# EAGLE design fmc-host-io-breakout (EAGLE 9.0.1)
DESIGNER: JON NEWMAN; DESIGN_NAME: FMC DESERIALIZER; LICENSE: CERN OHL v1.2; REVISION: 1.2
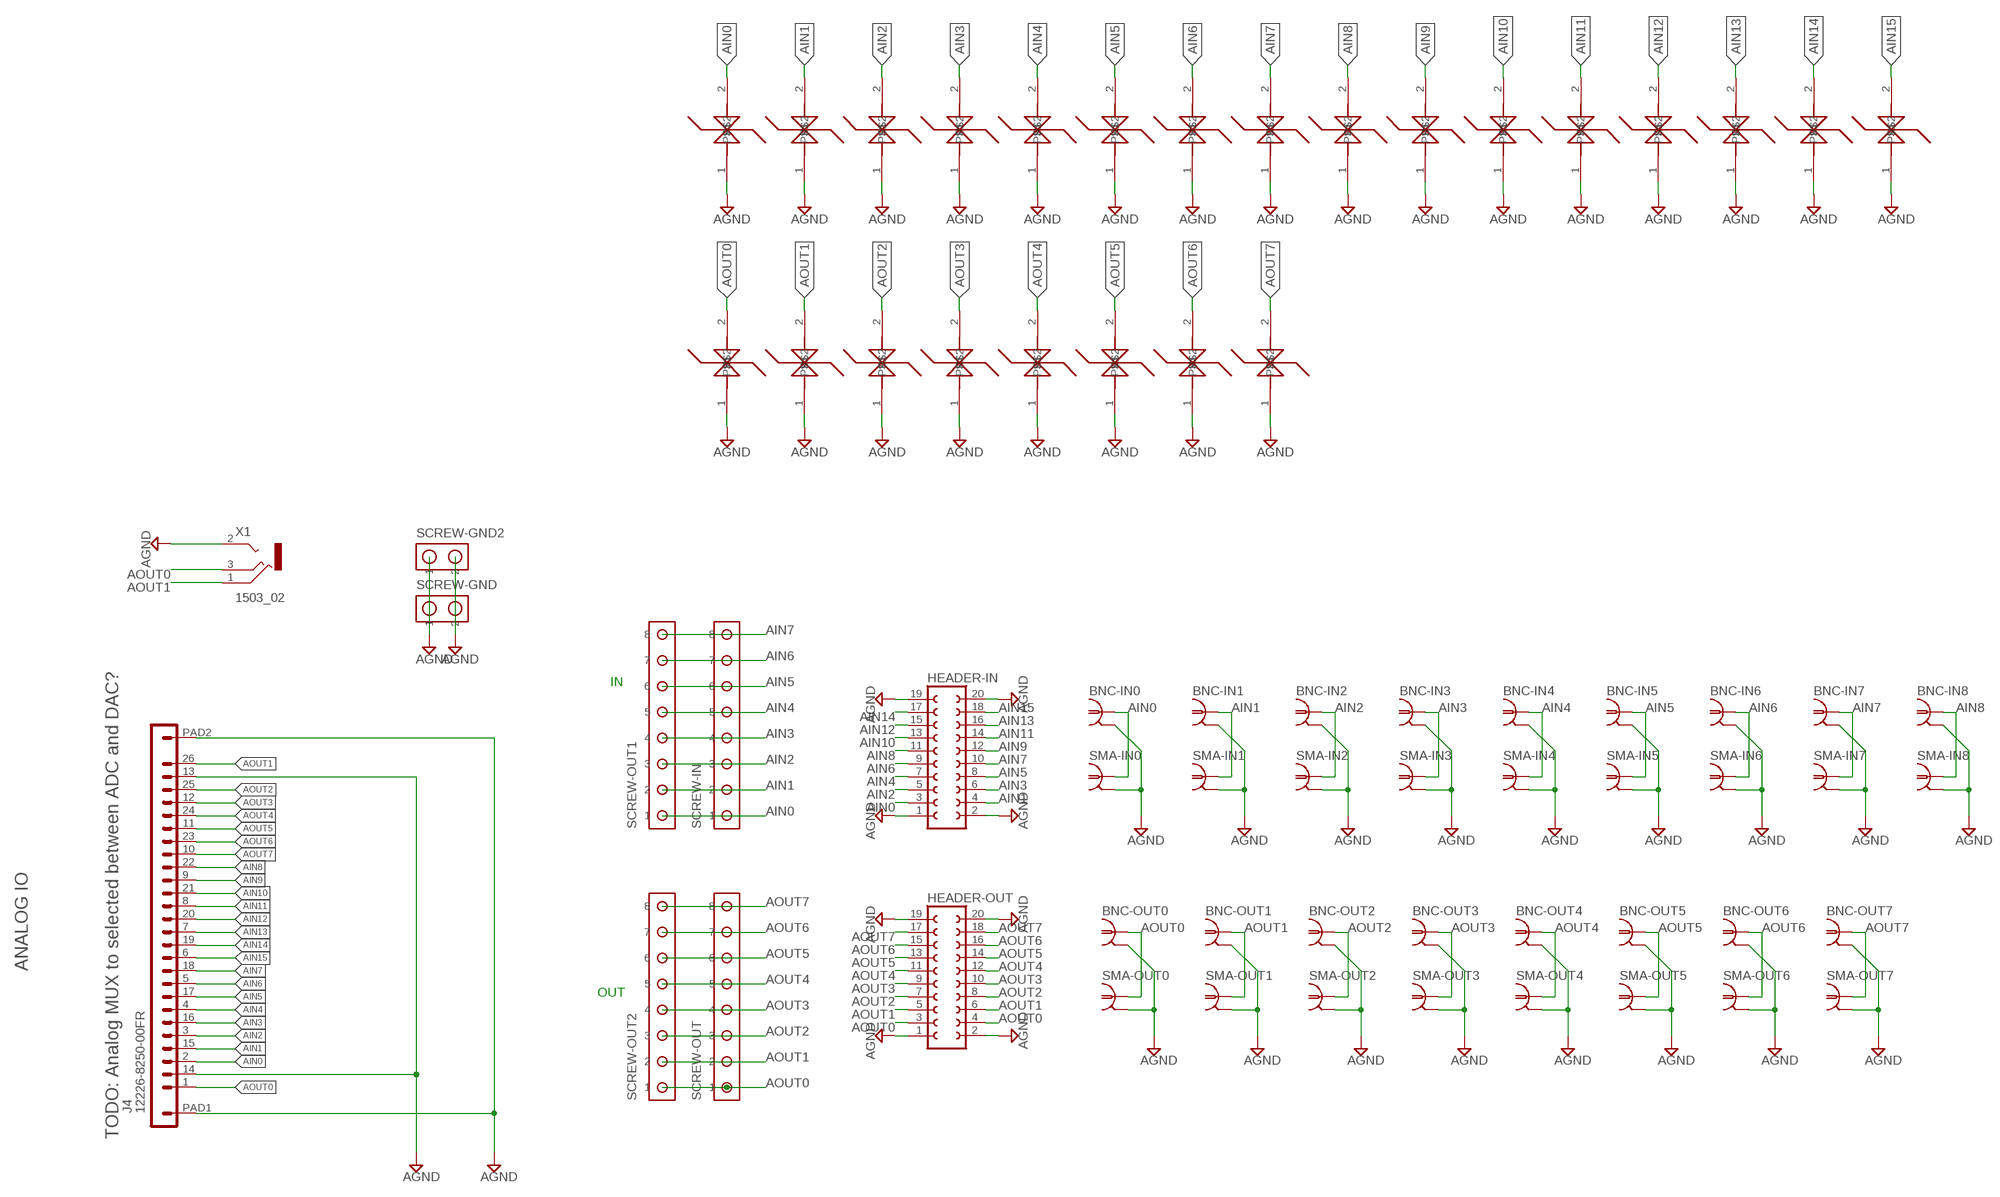
[diagram p0: schematic, sheet 1, part 1 of 2]
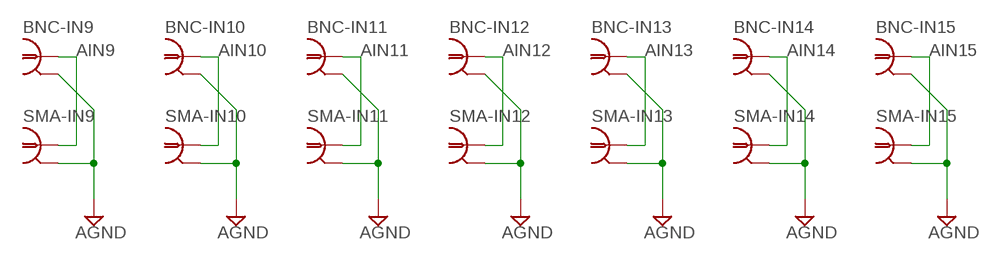
[diagram p1: schematic, sheet 1, part 2 of 2]

## Parts
BNC-IN0  COAX_B35N61  [B35N61]
BNC-IN1  COAX_B35N61  [B35N61]
BNC-IN2  COAX_B35N61  [B35N61]
BNC-IN3  COAX_B35N61  [B35N61]
BNC-IN4  COAX_B35N61  [B35N61]
BNC-IN5  COAX_B35N61  [B35N61]
BNC-IN6  COAX_B35N61  [B35N61]
BNC-IN7  COAX_B35N61  [B35N61]
BNC-IN8  COAX_B35N61  [B35N61]
BNC-IN9  COAX_B35N61  [B35N61]
BNC-IN10  COAX_B35N61  [B35N61]
BNC-IN11  COAX_B35N61  [B35N61]
BNC-IN12  COAX_B35N61  [B35N61]
BNC-IN13  COAX_B35N61  [B35N61]
BNC-IN14  COAX_B35N61  [B35N61]
BNC-IN15  COAX_B35N61  [B35N61]
BNC-OUT0  COAX_B35N61  [B35N61]
BNC-OUT1  COAX_B35N61  [B35N61]
BNC-OUT2  COAX_B35N61  [B35N61]
BNC-OUT3  COAX_B35N61  [B35N61]
BNC-OUT4  COAX_B35N61  [B35N61]
BNC-OUT5  COAX_B35N61  [B35N61]
BNC-OUT6  COAX_B35N61  [B35N61]
BNC-OUT7  COAX_B35N61  [B35N61]
HEADER-IN  FE10-2  [FE10-2]
HEADER-OUT  FE10-2  [FE10-2]
J4  12226-8250-00FR  PINHD-1X26_122  [12226-82X0-00XX]
SCREW-GND  SCREW2  [SCREW2]
SCREW-GND2  SCREW2  [SCREW2]
SCREW-IN  SCREW8  [SCREW8]
SCREW-OUT  SCREW8  [SCREW8]
SCREW-OUT1  SCREW8  [SCREW8]
SCREW-OUT2  SCREW8  [SCREW8]
SMA-IN0  COAX_SMA-VERT  [SMA_JACK_142-0701-201]
SMA-IN1  COAX_SMA-VERT  [SMA_JACK_142-0701-201]
SMA-IN2  COAX_SMA-VERT  [SMA_JACK_142-0701-201]
SMA-IN3  COAX_SMA-VERT  [SMA_JACK_142-0701-201]
SMA-IN4  COAX_SMA-VERT  [SMA_JACK_142-0701-201]
SMA-IN5  COAX_SMA-VERT  [SMA_JACK_142-0701-201]
SMA-IN6  COAX_SMA-VERT  [SMA_JACK_142-0701-201]
SMA-IN7  COAX_SMA-VERT  [SMA_JACK_142-0701-201]
SMA-IN8  COAX_SMA-VERT  [SMA_JACK_142-0701-201]
SMA-IN9  COAX_SMA-VERT  [SMA_JACK_142-0701-201]
SMA-IN10  COAX_SMA-VERT  [SMA_JACK_142-0701-201]
SMA-IN11  COAX_SMA-VERT  [SMA_JACK_142-0701-201]
SMA-IN12  COAX_SMA-VERT  [SMA_JACK_142-0701-201]
SMA-IN13  COAX_SMA-VERT  [SMA_JACK_142-0701-201]
SMA-IN14  COAX_SMA-VERT  [SMA_JACK_142-0701-201]
SMA-IN15  COAX_SMA-VERT  [SMA_JACK_142-0701-201]
SMA-OUT0  COAX_SMA-VERT  [SMA_JACK_142-0701-201]
SMA-OUT1  COAX_SMA-VERT  [SMA_JACK_142-0701-201]
SMA-OUT2  COAX_SMA-VERT  [SMA_JACK_142-0701-201]
SMA-OUT3  COAX_SMA-VERT  [SMA_JACK_142-0701-201]
SMA-OUT4  COAX_SMA-VERT  [SMA_JACK_142-0701-201]
SMA-OUT5  COAX_SMA-VERT  [SMA_JACK_142-0701-201]
SMA-OUT6  COAX_SMA-VERT  [SMA_JACK_142-0701-201]
SMA-OUT7  COAX_SMA-VERT  [SMA_JACK_142-0701-201]
U$1  DIODE-ESD-BIDIRECTIONALDO-214AA  [DIOC7026X260]
U$2  DIODE-ESD-BIDIRECTIONALDO-214AA  [DIOC7026X260]
U$3  DIODE-ESD-BIDIRECTIONALDO-214AA  [DIOC7026X260]
U$4  DIODE-ESD-BIDIRECTIONALDO-214AA  [DIOC7026X260]
U$5  DIODE-ESD-BIDIRECTIONALDO-214AA  [DIOC7026X260]
U$6  DIODE-ESD-BIDIRECTIONALDO-214AA  [DIOC7026X260]
U$7  DIODE-ESD-BIDIRECTIONALDO-214AA  [DIOC7026X260]
U$8  DIODE-ESD-BIDIRECTIONALDO-214AA  [DIOC7026X260]
U$9  DIODE-ESD-BIDIRECTIONALDO-214AA  [DIOC7026X260]
U$10  DIODE-ESD-BIDIRECTIONALDO-214AA  [DIOC7026X260]
U$11  DIODE-ESD-BIDIRECTIONALDO-214AA  [DIOC7026X260]
U$12  DIODE-ESD-BIDIRECTIONALDO-214AA  [DIOC7026X260]
U$13  DIODE-ESD-BIDIRECTIONALDO-214AA  [DIOC7026X260]
U$14  DIODE-ESD-BIDIRECTIONALDO-214AA  [DIOC7026X260]
U$15  DIODE-ESD-BIDIRECTIONALDO-214AA  [DIOC7026X260]
U$16  DIODE-ESD-BIDIRECTIONALDO-214AA  [DIOC7026X260]
U$17  DIODE-ESD-BIDIRECTIONALDO-214AA  [DIOC7026X260]
U$18  DIODE-ESD-BIDIRECTIONALDO-214AA  [DIOC7026X260]
U$19  DIODE-ESD-BIDIRECTIONALDO-214AA  [DIOC7026X260]
U$20  DIODE-ESD-BIDIRECTIONALDO-214AA  [DIOC7026X260]
U$21  DIODE-ESD-BIDIRECTIONALDO-214AA  [DIOC7026X260]
U$22  DIODE-ESD-BIDIRECTIONALDO-214AA  [DIOC7026X260]
U$23  DIODE-ESD-BIDIRECTIONALDO-214AA  [DIOC7026X260]
U$24  DIODE-ESD-BIDIRECTIONALDO-214AA  [DIOC7026X260]
X1  1503_02  [1503_02]

## Nets
AIN0: BNC-IN0.1 HEADER-IN.3 J4.2 SCREW-IN.1 SCREW-OUT1.1 SMA-IN0.CLK U$1.2
AIN1: BNC-IN1.1 HEADER-IN.4 J4.15 SCREW-IN.2 SCREW-OUT1.2 SMA-IN1.CLK U$2.2
AIN2: BNC-IN2.1 HEADER-IN.5 J4.3 SCREW-IN.3 SCREW-OUT1.3 SMA-IN2.CLK U$3.2
AIN3: BNC-IN3.1 HEADER-IN.6 J4.16 SCREW-IN.4 SCREW-OUT1.4 SMA-IN3.CLK U$4.2
AIN4: BNC-IN4.1 HEADER-IN.7 J4.4 SCREW-IN.5 SCREW-OUT1.5 SMA-IN4.CLK U$5.2
AIN5: BNC-IN5.1 HEADER-IN.8 J4.17 SCREW-IN.6 SCREW-OUT1.6 SMA-IN5.CLK U$6.2
AIN6: BNC-IN6.1 HEADER-IN.9 J4.5 SCREW-IN.7 SCREW-OUT1.7 SMA-IN6.CLK U$7.2
AIN7: BNC-IN7.1 HEADER-IN.10 J4.18 SCREW-IN.8 SCREW-OUT1.8 SMA-IN7.CLK U$8.2
AIN8: BNC-IN8.1 HEADER-IN.11 J4.22 SMA-IN8.CLK U$17.2
AIN9: BNC-IN9.1 HEADER-IN.12 J4.9 SMA-IN9.CLK U$18.2
AIN10: BNC-IN10.1 HEADER-IN.13 J4.21 SMA-IN10.CLK U$19.2
AIN11: BNC-IN11.1 HEADER-IN.14 J4.8 SMA-IN11.CLK U$20.2
AIN12: BNC-IN12.1 HEADER-IN.15 J4.20 SMA-IN12.CLK U$21.2
AIN13: BNC-IN13.1 HEADER-IN.16 J4.7 SMA-IN13.CLK U$22.2
AIN14: BNC-IN14.1 HEADER-IN.17 J4.19 SMA-IN14.CLK U$23.2
AIN15: BNC-IN15.1 HEADER-IN.18 J4.6 SMA-IN15.CLK U$24.2
AOUT0: BNC-OUT0.1 HEADER-OUT.3 HEADER-OUT.4 J4.1 SCREW-OUT2.1 SCREW-OUT.1 SMA-OUT0.CLK U$9.2 X1.3
AOUT1: BNC-OUT1.1 HEADER-OUT.5 HEADER-OUT.6 J4.26 SCREW-OUT2.2 SCREW-OUT.2 SMA-OUT1.CLK U$10.2 X1.1
AOUT2: BNC-OUT2.1 HEADER-OUT.7 HEADER-OUT.8 J4.25 SCREW-OUT2.3 SCREW-OUT.3 SMA-OUT2.CLK U$11.2
AOUT3: BNC-OUT3.1 HEADER-OUT.9 HEADER-OUT.10 J4.12 SCREW-OUT2.4 SCREW-OUT.4 SMA-OUT3.CLK U$12.2
AOUT4: BNC-OUT4.1 HEADER-OUT.11 HEADER-OUT.12 J4.24 SCREW-OUT2.5 SCREW-OUT.5 SMA-OUT4.CLK U$13.2
AOUT5: BNC-OUT5.1 HEADER-OUT.13 HEADER-OUT.14 J4.11 SCREW-OUT2.6 SCREW-OUT.6 SMA-OUT5.CLK U$14.2
AOUT6: BNC-OUT6.1 HEADER-OUT.15 HEADER-OUT.16 J4.23 SCREW-OUT2.7 SCREW-OUT.7 SMA-OUT6.CLK U$15.2
AOUT7: BNC-OUT7.1 HEADER-OUT.17 HEADER-OUT.18 J4.10 SCREW-OUT2.8 SCREW-OUT.8 SMA-OUT7.CLK U$16.2
GND: BNC-IN0.2 BNC-IN0.3 BNC-IN0.4 BNC-IN0.5 BNC-IN1.2 BNC-IN1.3 BNC-IN1.4 BNC-IN1.5 BNC-IN2.2 BNC-IN2.3 BNC-IN2.4 BNC-IN2.5 BNC-IN3.2 BNC-IN3.3 BNC-IN3.4 BNC-IN3.5 BNC-IN4.2 BNC-IN4.3 BNC-IN4.4 BNC-IN4.5 BNC-IN5.2 BNC-IN5.3 BNC-IN5.4 BNC-IN5.5 BNC-IN6.2 BNC-IN6.3 BNC-IN6.4 BNC-IN6.5 BNC-IN7.2 BNC-IN7.3 BNC-IN7.4 BNC-IN7.5 BNC-IN8.2 BNC-IN8.3 BNC-IN8.4 BNC-IN8.5 BNC-IN9.2 BNC-IN9.3 BNC-IN9.4 BNC-IN9.5 BNC-IN10.2 BNC-IN10.3 BNC-IN10.4 BNC-IN10.5 BNC-IN11.2 BNC-IN11.3 BNC-IN11.4 BNC-IN11.5 BNC-IN12.2 BNC-IN12.3 BNC-IN12.4 BNC-IN12.5 BNC-IN13.2 BNC-IN13.3 BNC-IN13.4 BNC-IN13.5 BNC-IN14.2 BNC-IN14.3 BNC-IN14.4 BNC-IN14.5 BNC-IN15.2 BNC-IN15.3 BNC-IN15.4 BNC-IN15.5 BNC-OUT0.2 BNC-OUT0.3 BNC-OUT0.4 BNC-OUT0.5 BNC-OUT1.2 BNC-OUT1.3 BNC-OUT1.4 BNC-OUT1.5 BNC-OUT2.2 BNC-OUT2.3 BNC-OUT2.4 BNC-OUT2.5 BNC-OUT3.2 BNC-OUT3.3 BNC-OUT3.4 BNC-OUT3.5 BNC-OUT4.2 BNC-OUT4.3 BNC-OUT4.4 BNC-OUT4.5 BNC-OUT5.2 BNC-OUT5.3 BNC-OUT5.4 BNC-OUT5.5 BNC-OUT6.2 BNC-OUT6.3 BNC-OUT6.4 BNC-OUT6.5 BNC-OUT7.2 BNC-OUT7.3 BNC-OUT7.4 BNC-OUT7.5 HEADER-IN.1 HEADER-IN.2 HEADER-IN.19 HEADER-IN.20 HEADER-OUT.1 HEADER-OUT.2 HEADER-OUT.19 HEADER-OUT.20 J4.13 J4.14 J4.PAD1 J4.PAD2 SCREW-GND2.P$1 SCREW-GND2.P$2 SCREW-GND.P$1 SCREW-GND.P$2 SMA-IN0.GND$1 SMA-IN0.GND$2 SMA-IN0.GND$3 SMA-IN0.GND$4 SMA-IN1.GND$1 SMA-IN1.GND$2 SMA-IN1.GND$3 SMA-IN1.GND$4 SMA-IN2.GND$1 SMA-IN2.GND$2 SMA-IN2.GND$3 SMA-IN2.GND$4 SMA-IN3.GND$1 SMA-IN3.GND$2 SMA-IN3.GND$3 SMA-IN3.GND$4 SMA-IN4.GND$1 SMA-IN4.GND$2 SMA-IN4.GND$3 SMA-IN4.GND$4 SMA-IN5.GND$1 SMA-IN5.GND$2 SMA-IN5.GND$3 SMA-IN5.GND$4 SMA-IN6.GND$1 SMA-IN6.GND$2 SMA-IN6.GND$3 SMA-IN6.GND$4 SMA-IN7.GND$1 SMA-IN7.GND$2 SMA-IN7.GND$3 SMA-IN7.GND$4 SMA-IN8.GND$1 SMA-IN8.GND$2 SMA-IN8.GND$3 SMA-IN8.GND$4 SMA-IN9.GND$1 SMA-IN9.GND$2 SMA-IN9.GND$3 SMA-IN9.GND$4 SMA-IN10.GND$1 SMA-IN10.GND$2 SMA-IN10.GND$3 SMA-IN10.GND$4 SMA-IN11.GND$1 SMA-IN11.GND$2 SMA-IN11.GND$3 SMA-IN11.GND$4 SMA-IN12.GND$1 SMA-IN12.GND$2 SMA-IN12.GND$3 SMA-IN12.GND$4 SMA-IN13.GND$1 SMA-IN13.GND$2 SMA-IN13.GND$3 SMA-IN13.GND$4 SMA-IN14.GND$1 SMA-IN14.GND$2 SMA-IN14.GND$3 SMA-IN14.GND$4 SMA-IN15.GND$1 SMA-IN15.GND$2 SMA-IN15.GND$3 SMA-IN15.GND$4 SMA-OUT0.GND$1 SMA-OUT0.GND$2 SMA-OUT0.GND$3 SMA-OUT0.GND$4 SMA-OUT1.GND$1 SMA-OUT1.GND$2 SMA-OUT1.GND$3 SMA-OUT1.GND$4 SMA-OUT2.GND$1 SMA-OUT2.GND$2 SMA-OUT2.GND$3 SMA-OUT2.GND$4 SMA-OUT3.GND$1 SMA-OUT3.GND$2 SMA-OUT3.GND$3 SMA-OUT3.GND$4 SMA-OUT4.GND$1 SMA-OUT4.GND$2 SMA-OUT4.GND$3 SMA-OUT4.GND$4 SMA-OUT5.GND$1 SMA-OUT5.GND$2 SMA-OUT5.GND$3 SMA-OUT5.GND$4 SMA-OUT6.GND$1 SMA-OUT6.GND$2 SMA-OUT6.GND$3 SMA-OUT6.GND$4 SMA-OUT7.GND$1 SMA-OUT7.GND$2 SMA-OUT7.GND$3 SMA-OUT7.GND$4 U$1.1 U$2.1 U$3.1 U$4.1 U$5.1 U$6.1 U$7.1 U$8.1 U$9.1 U$10.1 U$11.1 U$12.1 U$13.1 U$14.1 U$15.1 U$16.1 U$17.1 U$18.1 U$19.1 U$20.1 U$21.1 U$22.1 U$23.1 U$24.1 X1.2 ; supply symbol labelled AGND
Unconnected: X1.2@2

## Notes on the sheet
- IN
- ANALOG IO
- OUT
- TODO: Analog MUX to selected between ADC and DAC?

## Library data of the parts
BNC-IN0 BNC-IN1-BNC-IN15 BNC-OUT0 BNC-OUT1-BNC-OUT7 = jonnew:COAX: COAX CONNECTOR - Edge mount BNC - Vertical BNC - Vertical SMA - etc; OC_FARNELL: unknown; OC_NEWARK: unknown
HEADER-IN HEADER-OUT = con-lsta:FE10-2: FEMALE HEADER; OC_FARNELL: unknown; OC_NEWARK: unknown
J4 = jonnew:PINHD-1X26
SCREW-GND SCREW-GND2 = jonnew:SCREW2: Screw Terminal
SCREW-IN SCREW-OUT SCREW-OUT1 SCREW-OUT2 = jonnew:SCREW8: Screw Terminal
SMA-IN0 SMA-IN1-SMA-IN15 SMA-OUT0 SMA-OUT1-SMA-OUT7 = jonnew:COAX: COAX CONNECTOR - Edge mount BNC - Vertical BNC - Vertical SMA - etc
U$1-U$24 = jonnew:DIODE-ESD-BIDIRECTIONAL
X1 = con-lumberg:1503_02: Jack connectors according to JISC 6560, 3.5 mm Klinkeneinbaukupplung nach JISC 6560, 3,5 mm, 3-polig/stereo, abgewinkelte Ausführung, Surface-Mount-Technik (SMT) Source: http://www.lumberg.com/Produkte/PDFs/1503_02.pdf; OC_FARNELL: 1216979; OC_NEWARK: unknown

## Net classes
1 diff: width 0.229 mm, drill 0.33 mm, clearance 0.127 mm

## Board
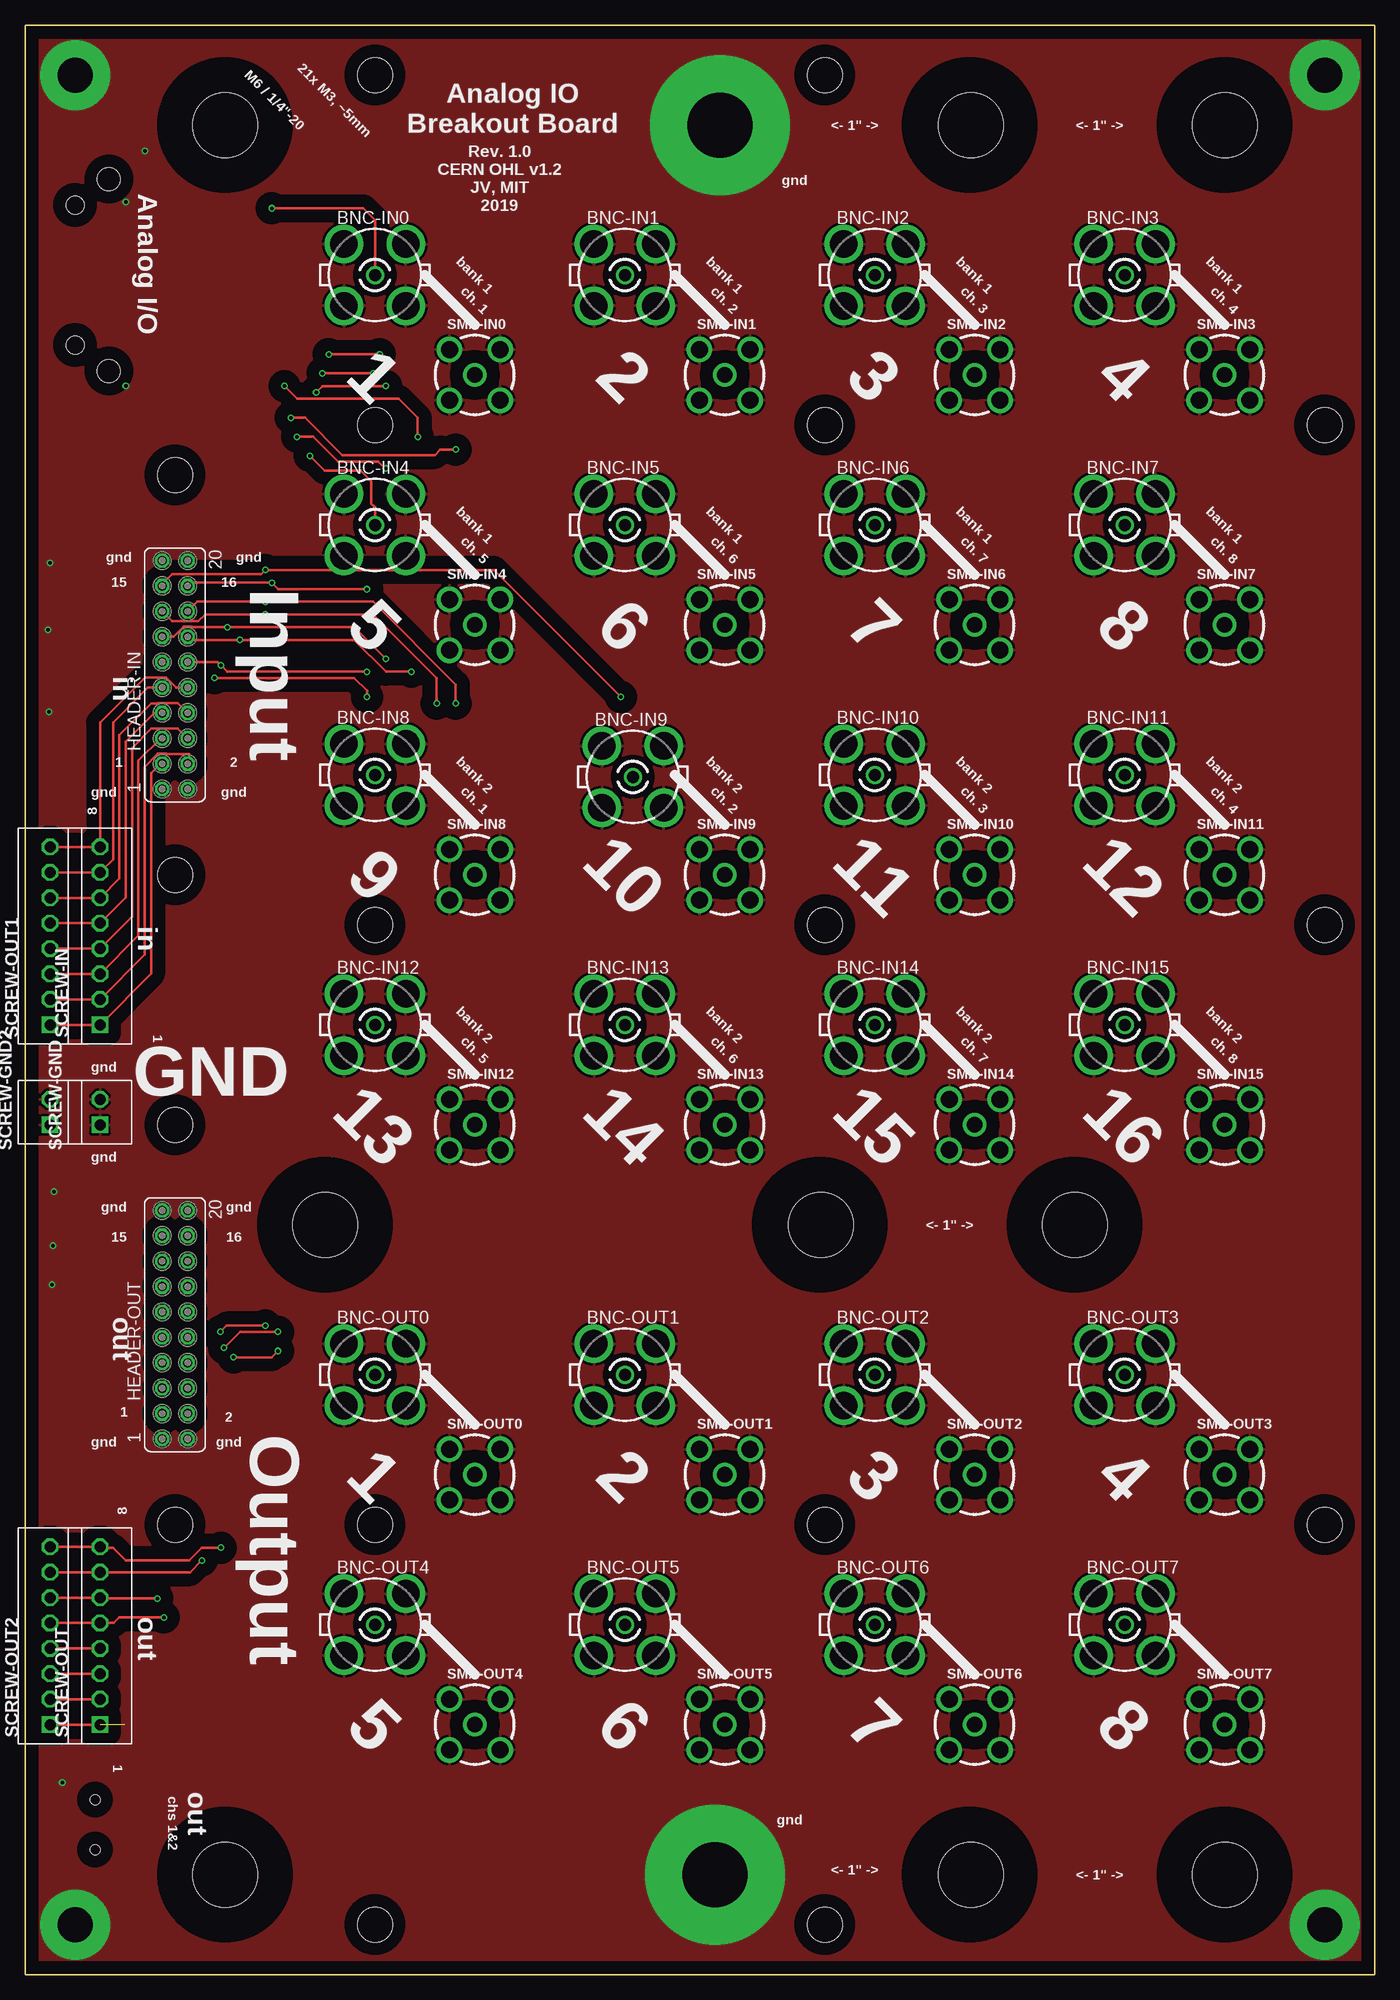
[diagram p2: board, top side]
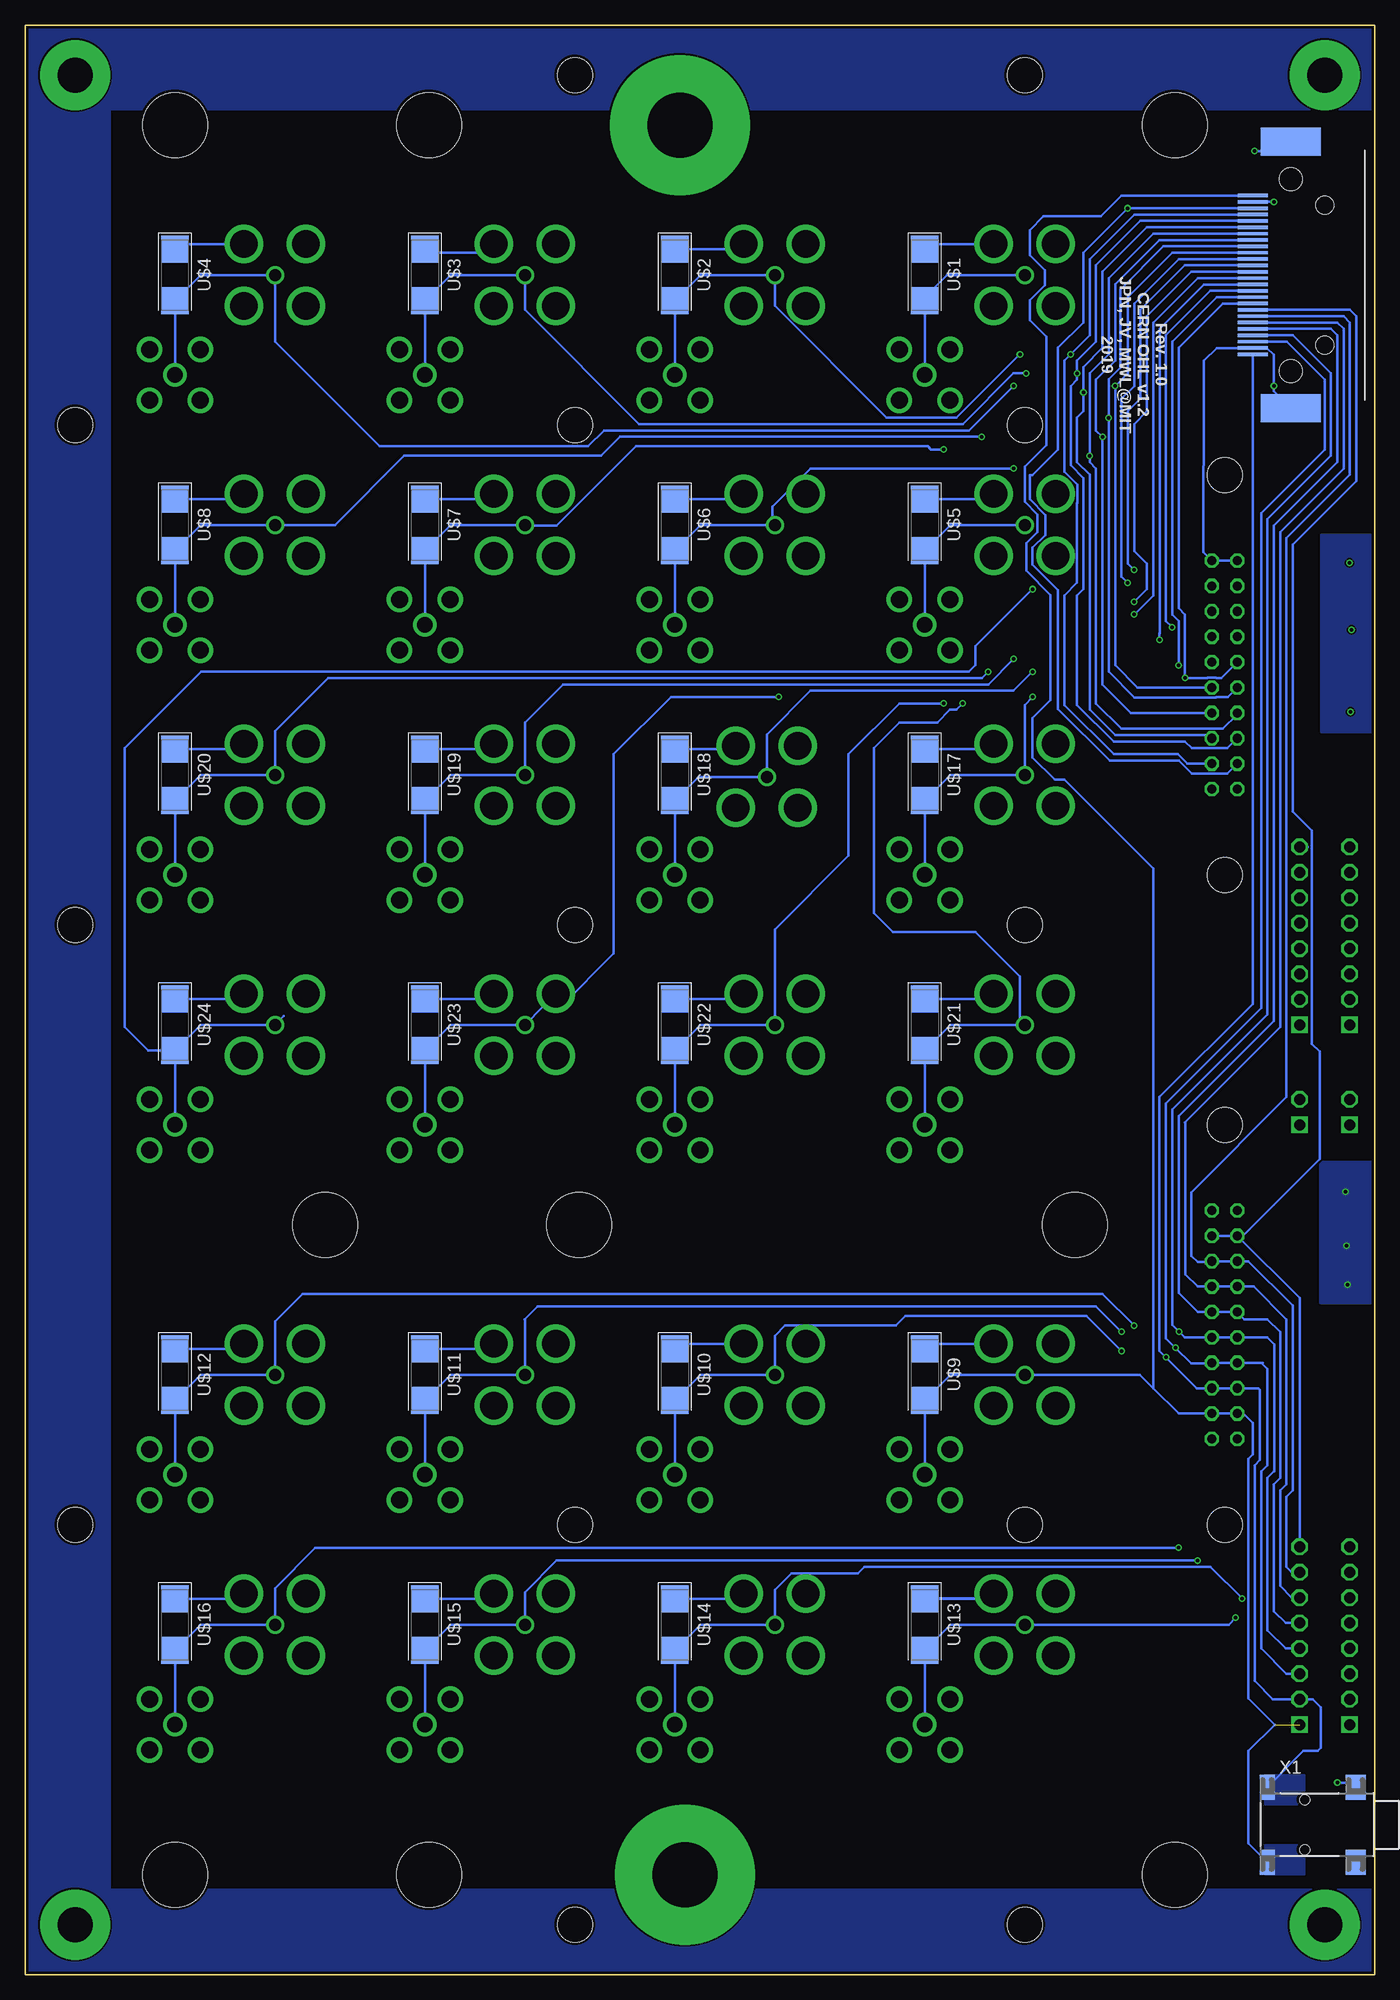
[diagram p3: board, bottom side, seen from below]

Size 135 x 195 mm. Coordinates in mm from the lower left corner, seen from the top.
Outline: 0,195 135,195 135,0 0,0 0,195
Copper layers (1*16): Top 0.035mm / dielectric 1.5mm / Bottom 0.035mm
Design rules "Seeed Fusion Design Rules": minimum track width 6mil, minimum drill 12mil, track to track 6mil, track to pad 6mil, pad to pad 6mil, via to via 6mil, smd to smd 0mil, copper to edge 10mil, drill to drill 10mil, minimum pad ring 10mil, minimum via ring 6mil, stop-mask expansion 2mil, vias tented up to drill 100mil, thermal gap 10mil
Holes 3.5 mm at 80,5 80,190 35,155 35,105 80,105 80,155 35,45 80,45 35,190 35,5 130,105 130,45 130,155 15,85 15,45 15,110 15,150
Holes 6.5 mm at 20,10 20,185 120,10 120,185 105,75 30,75 94.6,185 79.6,75 94.6,10
tRestrict: area 89.1,179.6 to 99.9,190.4; area 114.6,179.6 to 125.4,190.4; area 24.6,69.6 to 35.4,80.4; area 74.1,69.6 to 84.9,80.4; area 99.6,69.6 to 110.4,80.4; area 114.6,4.6 to 125.4,15.4; area 89.1,4.6 to 99.9,15.4; area 14.6,4.6 to 25.4,15.4; area 14.6,179.6 to 25.4,190.4

### Footprints (pad centres in the part's own frame; a part is rotated, then mirrored left to right if it is on the bottom)
B35N61 = drill 1.2: 1 0,0 | drill 2.794: 2 3.099,3.099; 3 -3.099,3.099; 4 -3.099,-3.099; 5 3.099,-3.099
FE10-2 = drill 0.914 octagon: 1 -11.43,1.27; 2 -11.43,-1.27; 3 -8.89,1.27; 4 -8.89,-1.27; 5 -6.35,1.27; 6 -6.35,-1.27; 7 -3.81,1.27; 8 -3.81,-1.27; 9 -1.27,1.27; 10 -1.27,-1.27; 11 1.27,1.27; 12 1.27,-1.27; 13 3.81,1.27; 14 3.81,-1.27; 15 6.35,1.27; 16 6.35,-1.27; 17 8.89,1.27; 18 8.89,-1.27; 19 11.43,1.27; 20 11.43,-1.27
12226-82X0-00XX = smd 0.335 x 3: 1 7.938,7.2; 2 6.668,7.2; 3 5.397,7.2; 4 4.128,7.2; 5 2.857,7.2; 6 1.587,7.2; 7 0.318,7.2; 8 -0.953,7.2; 9 -2.223,7.2; 10 -3.493,7.2; 11 -4.763,7.2; 12 -6.032,7.2; 13 -7.303,7.2; 14 7.303,7.2; 15 6.032,7.2; 16 4.763,7.2; 17 3.493,7.2; 18 2.223,7.2; 19 0.953,7.2; 20 -0.318,7.2; 21 -1.587,7.2; 22 -2.857,7.2; 23 -4.128,7.2; 24 -5.397,7.2; 25 -6.668,7.2; 26 -7.938,7.2 | smd 2.8 x 6: PAD1 -13.3,3.4; PAD2 13.3,3.4 | hole 1.8: 7,0; -7,0 | hole 2.3: 9.6,3.4; -9.6,3.4
SCREW2 = drill 1.1 square: P$1 0,0 | drill 1.1 octagon: P$2 2.54,0
SCREW8 = drill 1.1 square: 1 0,0 | drill 1.1 octagon: 2 2.54,0; 3 5.08,0; 4 7.62,0; 5 10.16,0; 6 12.7,0; 7 15.24,0; 8 17.78,0
SMA_JACK_142-0701-201 = drill 1.575: CLK 0,0 | drill 1.702: GND$1 -2.54,2.54; GND$2 2.54,2.54; GND$3 -2.54,-2.54; GND$4 2.54,-2.54
DIOC7026X260 = smd 2.71 x 2.75: 1 -2.57,0; 2 2.57,0
1503_02 = smd 2.5 x 1.5: 1 -3.75,-10.75; 3 3.75,-10.75 | smd 2.5 x 2: 2 -3.75,-1.9; 2@2 3.75,-1.9 | hole 1: -2.5,-7; 2.5,-7

### Placement (x,y rotation side)
BNC-IN0  35,170 0 top
BNC-IN1  60,170 0 top
BNC-IN2  85,170 0 top
BNC-IN3  110,170 0 top
BNC-IN4  35,145 0 top
BNC-IN5  60,145 0 top
BNC-IN6  85,145 0 top
BNC-IN7  110,145 0 top
BNC-IN8  35,120 0 top
BNC-IN9  60.8,119.8 0 top
BNC-IN10  85,120 0 top
BNC-IN11  110,120 0 top
BNC-IN12  35,95 0 top
BNC-IN13  60,95 0 top
BNC-IN14  85,95 0 top
BNC-IN15  110,95 0 top
BNC-OUT0  35,60 0 top
BNC-OUT1  60,60 0 top
BNC-OUT2  85,60 0 top
BNC-OUT3  110,60 0 top
BNC-OUT4  35,35 0 top
BNC-OUT5  60,35 0 top
BNC-OUT6  85,35 0 top
BNC-OUT7  110,35 0 top
HEADER-IN  15,130 90 top
HEADER-OUT  15,65 90 top
J4  5,170 90 bottom
SCREW-GND  7.5,85 90 top
SCREW-GND2  2.5,85 90 top
SCREW-IN  7.5,95 90 top
SCREW-OUT  7.5,25 90 top
SCREW-OUT1  2.5,95 90 top
SCREW-OUT2  2.5,25 90 top
SMA-IN0  45,160 0 top
SMA-IN1  70,160 0 top
SMA-IN2  95,160 0 top
SMA-IN3  120,160 0 top
SMA-IN4  45,135 0 top
SMA-IN5  70,135 0 top
SMA-IN6  95,135 0 top
SMA-IN7  120,135 0 top
SMA-IN8  45,110 0 top
SMA-IN9  70,110 0 top
SMA-IN10  95,110 0 top
SMA-IN11  120,110 0 top
SMA-IN12  45,85 0 top
SMA-IN13  70,85 0 top
SMA-IN14  95,85 0 top
SMA-IN15  120,85 0 top
SMA-OUT0  45,50 0 top
SMA-OUT1  70,50 0 top
SMA-OUT2  95,50 0 top
SMA-OUT3  120,50 0 top
SMA-OUT4  45,25 0 top
SMA-OUT5  70,25 0 top
SMA-OUT6  95,25 0 top
SMA-OUT7  120,25 0 top
U$1  45,170 270 bottom
U$2  70,170 270 bottom
U$3  95,170 270 bottom
U$4  120,170 270 bottom
U$5  45,145 270 bottom
U$6  70,145 270 bottom
U$7  95,145 270 bottom
U$8  120,145 270 bottom
U$9  45,60 270 bottom
U$10  70,60 270 bottom
U$11  95,60 270 bottom
U$12  120,60 270 bottom
U$13  45,35 270 bottom
U$14  70,35 270 bottom
U$15  95,35 270 bottom
U$16  120,35 270 bottom
U$17  45,120 270 bottom
U$18  70,120 270 bottom
U$19  95,120 270 bottom
U$20  120,120 270 bottom
U$21  45,95 270 bottom
U$22  70,95 270 bottom
U$23  95,95 270 bottom
U$24  120,95 270 bottom
X1  0,15 270 bottom

### Tracks (layer width: path | path; a pad name or v marks a point on that pad's centre or on a via)
AIN0  (via drill 0.35)
  Top 0.254: HEADER-IN.3 13.57,121.11 12.62,120.16 12.62,100.11 SCREW-IN.1 SCREW-OUT1.1 | BNC-IN0.1 35,175.5 33.83,176.68 v24.68,176.68
  Bottom 0.254: SMA-IN0.CLK U$1.2 45,167.78 42.78,170 BNC-IN0.1 | J4.2 v24.68,176.68 29.12,172.23 29.12,165.25 31.66,162.7 31.66,152.55 34.21,150 34.5,150 34.5,147.56 32.94,146 32.94,143.97 34.2,142.7 34.2,141.04 31.66,138.5 31.66,126.59 26.5,121.43 19.6,121.43 18.29,120.12 14.72,120.12 HEADER-IN.3
AIN1  (via drill 0.35)
  Top 0.254: v35.48,162.07 30.4,162.07 v30.39,162.06 | HEADER-IN.4 16.43,121.27 16.43,122.06 14.18,122.06 14.14,122.1 13.29,122.1 11.98,120.8 11.98,102.02 SCREW-IN.2 SCREW-OUT1.2
  Bottom 0.254: SMA-IN1.CLK U$2.2 67.43,170 BNC-IN1.1 60,166.91 48.81,155.72 41.83,155.72 v35.48,162.07 | J4.15 24.05,176.03 28.48,171.59 28.48,163.97 v30.39,162.06 31.02,161.44 31.03,161.44 31.03,150.32 29.72,149 29.72,147.19 29.76,147.15 29.76,139.21 31.03,137.94 31.03,127 26.09,122.06 19.66,122.06 18.7,121.11 HEADER-IN.4
AIN2  (via drill 0.35)
  Top 0.254: v34.84,160.16 v29.76,160.16 | HEADER-IN.5 13.57,123.65 11.34,121.43 11.34,103.92 SCREW-IN.3 SCREW-OUT1.3
  Bottom 0.254: SMA-IN2.CLK U$3.2 92.43,170 BNC-IN2.1 85,166.51 73.58,155.09 41.19,155.09 36.11,160.16 v34.84,160.16 | J4.3 23.41,175.41 27.86,170.96 27.86,163.34 29.76,161.44 v29.76,160.16 29.76,159.53 30.39,158.9 30.39,150.96 29.12,149.69 29.12,138.57 29.76,137.94 29.76,127 26.09,123.34 18.96,123.34 18.29,122.66 14.72,122.66 HEADER-IN.5
AIN3  (via drill 0.35)
  Top 0.254: v36.11,158.9 29.76,158.9 v29.12,158.26 | HEADER-IN.6 15.28,124.64 13.32,124.64 13.28,124.61 12.62,124.61 10.71,122.7 10.71,105.83 SCREW-IN.4 SCREW-OUT1.4
  Bottom 0.254: SMA-IN3.CLK U$4.2 117.43,170 BNC-IN3.1 110,163.34 99.53,152.87 78.66,152.87 77.07,154.45 40.55,154.45 v36.11,158.9 | J4.16 22.77,174.76 27.21,170.32 27.21,162.71 29.12,160.8 v29.12,158.26 29.12,156.35 29.76,155.72 29.76,151.28 28.49,150 28.49,126.51 25.95,123.97 16.59,123.97 HEADER-IN.6
AIN4  (via drill 0.35)
  Top 0.254: BNC-IN4.1 35,146.77 34.64,147.14 34.64,149.36 33.55,150.45 29.95,150.45 v28.49,151.91 | HEADER-IN.7 12.93,126.19 10.08,123.34 10.08,107.73 SCREW-IN.5 SCREW-OUT1.5
  Bottom 0.254: BNC-IN4.1 42.43,145 U$5.2 SMA-IN4.CLK | J4.4 22.14,174.13 26.58,169.69 26.58,162.08 28.49,160.16 v28.49,151.91 28.49,151.28 27.86,150.64 27.86,127.14 25.32,124.61 16.72,124.61 16.68,124.64 15.86,124.64 15.82,124.61 15.16,124.61 13.73,126.03 HEADER-IN.7
AIN5  (via drill 0.35)
  Top 0.254: HEADER-IN.8 15.28,127.18 13.32,127.18 13.28,127.14 12.62,127.14 9.44,123.97 9.44,109.64 SCREW-IN.6 SCREW-OUT1.6 | v36.11,150.64 36,150.64 35.32,151.32 31.32,151.32 28.82,153.81 v27.22,153.81
  Bottom 0.254: BNC-IN5.1 60.24,145 | 60.24,145 67.43,145 U$6.2 SMA-IN5.CLK | J4.17 21.5,173.5 25.95,169.06 25.95,161.44 27.86,159.53 27.86,154.45 v27.22,153.81 27.22,129.05 24.36,126.19 HEADER-IN.8 | v36.11,150.64 56.43,150.64 60.24,146.83 60.24,145
AIN6  (via drill 0.35)
  Top 0.254: v26.59,155.72 28,155.72 31.72,152 41,152 41.55,152.55 v43.09,152.55 | HEADER-IN.9 12.3,128.73 8.8,125.24 8.8,111.55 7.68,110.42 SCREW-IN.7 SCREW-OUT1.7
  Bottom 0.254: SMA-IN6.CLK U$7.2 92.43,145 BNC-IN6.1 84.92,144.93 81.83,144.93 73.89,152.86 44.68,152.86 44.37,152.55 v43.09,152.55 | HEADER-IN.9 14.68,127.78 15.82,127.78 15.86,127.74 24,127.74 26.59,130.32 v26.59,155.72 26.59,159.59 25.43,160.75 25.43,168.53 21.11,172.86 J4.5
AIN7  (via drill 0.35)
  Top 0.254: v25.95,158.9 27.22,157.62 37.38,157.62 39.28,155.72 v39.28,153.81 | HEADER-IN.10 15.13,128.73 14.14,129.72 12.02,129.72 7.5,125.2 SCREW-IN.8 SCREW-OUT1.8
  Bottom 0.254: SMA-IN7.CLK U$8.2 117.43,145 BNC-IN7.1 103.98,145 97.07,151.91 77.38,151.91 75.48,153.81 v39.28,153.81 | J4.18 20.23,172.22 24.67,167.78 24.67,160.17 v25.95,158.9 25.95,130.95 23.73,128.73 HEADER-IN.10 | SCREW-IN.8 6.67,112.78
AIN8  (via drill 0.35)
  Top 0.254: v34.2,127.78 34.2,128.41 32.94,129.69 v18.96,129.69
  Bottom 0.254: SMA-IN8.CLK U$17.2 42.43,120 BNC-IN8.1 35,126.98 v34.2,127.78 | J4.22 15.16,167.15 19.6,162.7 19.6,136.67 18.96,136.03 v18.96,129.69 16.72,129.69 16.68,129.72 15.86,129.72 15.82,129.69 15.32,129.69 HEADER-IN.11
AIN9  (via drill 0.35)
  Top 0.254: HEADER-IN.12 19.29,131.27 v19.6,130.95 20.23,130.32 v34.2,130.32
  Bottom 0.254: SMA-IN9.CLK U$18.2 67.63,119.8 BNC-IN9.1 60.8,124.05 56.43,128.41 36.11,128.41 v34.2,130.32 | J4.9 15.79,167.78 20.23,163.34 20.23,136.03 19.6,135.4 v19.6,130.95
AIN10  (via drill 0.35)
  Top 0.254: HEADER-IN.13 14.87,133.81 15.86,134.8 16.68,134.8 16.72,134.76 v20.23,134.76 32.94,134.76 v36.11,131.59
  Bottom 0.254: SMA-IN10.CLK U$19.2 92.43,120 BNC-IN10.1 85,125.25 81.19,129.05 38.65,129.05 v36.11,131.59 | J4.21 16.43,168.42 20.87,163.97 20.87,135.4 v20.23,134.76
AIN11  (via drill 0.35)
  Top 0.254: HEADER-IN.14 16.59,133.5 v21.5,133.5 32.94,133.5 36.11,130.32 v38.65,130.32
  Bottom 0.254: SMA-IN11.CLK U$20.2 117.43,120 BNC-IN11.1 110,124.38 104.69,129.69 39.28,129.69 v38.65,130.32 | J4.8 17.06,169.05 21.5,164.61 21.5,134.14 21.5,134.13 v21.5,133.5
AIN12  (via drill 0.35)
  Top 0.254: HEADER-IN.15 14.72,135.36 17.32,135.36 18,136.03 v24.05,136.03 34.84,136.03 41.19,129.69 v41.19,127.14
  Bottom 0.254: SMA-IN12.CLK U$21.2 42.43,95 BNC-IN12.1 35.48,95.47 35.48,99.84 39.92,104.28 48.17,104.28 50.08,106.19 50.08,122.7 47.54,125.24 43.73,125.24 42.46,126.51 41.83,126.51 v41.19,127.14 | J4.20 17.7,169.69 22.14,165.25 22.14,137.94 v24.05,136.03
AIN13  (via drill 0.35)
  Top 0.254: HEADER-IN.16 17.23,137.31 v24.05,137.31 34.84,137.31 43.09,129.05 v43.09,127.14
  Bottom 0.254: SMA-IN13.CLK U$22.2 67.43,95 BNC-IN13.1 60,104.53 52.62,111.91 52.62,122.06 47.54,127.14 v43.09,127.14 | J4.7 18.33,170.32 22.77,165.88 22.77,156.35 24.05,155.09 24.05,142.38 22.77,141.12 22.77,138.57 v24.05,137.31
AIN14  (via drill 0.35)
  Top 0.254: HEADER-IN.17 13.73,139.06 14.74,140.07 23.63,140.07 v24.05,140.48 46.91,140.48 v59.61,127.78
  Bottom 0.254: SMA-IN14.CLK U$23.2 92.43,95 BNC-IN14.1 83.16,96.84 81.38,96.84 76.11,102.11 76.11,122.06 70.4,127.78 v59.61,127.78 | J4.19 18.96,170.95 23.4,166.51 23.4,157.63 24.68,156.35 24.68,141.12 v24.05,140.48
AIN15  (via drill 0.35)
  Top 0.254: HEADER-IN.18 16.59,139.21 v24.68,139.21 25.32,138.57 v34.2,138.57
  Bottom 0.254: U$24.2 117.43,95 BNC-IN15.1 109.14,95.86 | U$24.2 SMA-IN15.CLK | J4.6 19.6,171.59 24.05,167.15 24.05,158.9 25.32,157.62 25.32,139.84 v24.68,139.21 | v34.2,138.57 39.92,132.86 39.92,130.95 40.55,130.32 117.39,130.32 125.01,122.7 125.01,94.76 122.68,92.43 U$24.2
ANGD
  pour Bottom: 0,144 5.4,144 5.4,124.3 0,124.3
AOUT0  (1 unrouted)
  Top 0.254: SCREW-OUT2.1 SCREW-OUT.1
  Bottom 0.254: SMA-OUT0.CLK U$9.2 42.43,60 BNC-OUT0.1 23.49,60 22.14,58.65 | J4.1 25.32,177.94 27.38,175.88 33.12,175.88 34.5,174.5 34.5,172 33,170.5 33,169 34.5,167.5 34.5,165.5 32.82,163.82 32.82,153 35,150.82 35,147.31 33.73,146.04 33.73,144.29 34.84,143.18 34.84,140.43 32.41,138 32.41,127.46 34.2,125.67 34.2,121.75 31.97,119.51 31.03,119.51 22.14,110.62 22.14,58.65 | X1.3 12.62,13.11 12.62,22.37 9.98,25 12.62,27.63 12.62,51.58 12.19,52.01 12.19,55.19 13.11,56.11 HEADER-OUT.3 HEADER-OUT.4 19.6,56.11 22.14,58.65
  pour Bottom (no thermals): 11,13 7,13 7,10 11,10
AOUT1  (via drill 0.35)
  Top 0.254: v25.32,62.38 24.68,61.74 v20.87,61.74 | SCREW-OUT.2 SCREW-OUT2.2
  Bottom 0.254: SMA-OUT1.CLK U$10.2 67.43,60 BNC-OUT1.1 60,63.88 58.97,64.91 47.86,64.91 46.91,65.87 28.81,65.87 v25.32,62.38 | X1.1 7.13,22.37 5.7,22.37 5.4,22.67 5.4,26.74 6.2,27.54 SCREW-OUT.2 10.16,27.54 11.98,29.36 11.98,50.95 11.45,51.47 11.45,58.45 11.65,58.65 HEADER-OUT.5 HEADER-OUT.6 17.78,58.65 v20.87,61.74 21.5,62.38 21.5,87.78 12.2,97.08 J4.26
  pour Bottom (no thermals): 11,20 7,20 7,17 11,17
AOUT2  (via drill 0.35)
  Top 0.254: v25.32,64.28 21.5,64.28 v19.92,62.69 | SCREW-OUT2.3 SCREW-OUT.3
  Bottom 0.254: SMA-OUT2.CLK U$11.2 92.43,60 BNC-OUT2.1 85,65.55 83.73,66.82 27.86,66.82 v25.32,64.28 | 11.19,61.19 11.34,61.19 | 11.34,61.19 HEADER-OUT.7 HEADER-OUT.8 16.36,61.1 18.33,61.1 v19.92,62.69 20.87,63.65 20.87,87.14 11.34,96.66 11.34,146.19 4.99,152.55 4.99,159.53 8.8,163.33 J4.25 | SCREW-OUT.3 8.8,30.08 11.34,32.62 11.34,50.31 10.71,50.95 10.71,60.55 11.34,61.19
AOUT3  (via drill 0.35)
  Top 0.254: v24.05,64.91 20.15,64.91 v19.56,64.32 | SCREW-OUT.4 SCREW-OUT2.4
  Bottom 0.254: SMA-OUT3.CLK U$12.2 117.43,60 BNC-OUT3.1 110,65.32 107.23,68.09 27.22,68.09 v24.05,64.91 | J4.12 8.18,163.97 8.17,163.97 4.36,160.16 4.36,151.91 10.71,145.56 10.71,96.03 20.23,86.5 20.23,65 v19.56,64.32 18.96,63.73 HEADER-OUT.10 HEADER-OUT.9 10.73,63.73 10.04,63.04 10.04,50.31 10.08,50.31 10.71,49.67 10.71,34.44 8.9,32.62 SCREW-OUT.4
AOUT4  (via drill 0.35)
  Top 0.254: v13.89,35.7 9.44,35.7 8.9,35.16 7.7,35.16 SCREW-OUT.5 SCREW-OUT2.5
  Bottom 0.254: SMA-OUT4.CLK U$13.2 42.43,35 BNC-OUT4.1 14.59,35 v13.89,35.7 | J4.24 4.35,164.6 3.72,163.97 3.72,162.47 3.73,162.46 3.73,151.28 10.08,144.93 10.08,95.39 19.6,85.87 19.6,68.17 17.7,66.27 HEADER-OUT.12 HEADER-OUT.11 13.01,65.55 10.71,65.55 9.44,64.28 9.44,49.67 10.08,49.04 10.08,36.34 8.9,35.16 SCREW-OUT.5
AOUT5  (via drill 0.35)
  Top 0.254: v13.25,37.61 7.59,37.61 SCREW-OUT.6 SCREW-OUT2.6
  Bottom 0.254: SMA-OUT5.CLK U$14.2 67.43,35 BNC-OUT5.1 60,38.48 58.34,40.15 51.67,40.15 51.03,40.78 16.43,40.78 v13.25,37.61 | J4.11 3.73,165.25 3.09,164.61 3.09,150.64 9.44,144.29 9.44,94.76 18.96,85.23 18.92,85.19 18.92,70.04 17.7,68.81 HEADER-OUT.14 HEADER-OUT.13 12.06,68.81 8.8,65.55 8.8,49.04 9.44,48.41 9.44,38.88 8.26,37.7 SCREW-OUT.6
AOUT6  (via drill 0.35)
  Top 0.254: v17.7,41.42 16.52,40.24 SCREW-OUT.7 SCREW-OUT2.7
  Bottom 0.254: SMA-OUT6.CLK U$15.2 92.43,35 BNC-OUT6.1 85,38.25 81.83,41.42 v17.7,41.42 | J4.23 3.72,165.87 3.71,165.88 3.09,165.88 2.45,165.25 2.45,150 8.8,143.66 8.8,87.78 18.33,78.25 18.33,71.9 17.7,71.27 16.36,71.27 HEADER-OUT.16 HEADER-OUT.15 12.62,71.35 8.17,66.91 8.17,48.41 8.8,47.77 8.8,40.78 8.26,40.24 SCREW-OUT.7
AOUT7  (via drill 0.35)
  Top 0.254: v19.6,42.69 17.7,42.69 16.43,41.42 10.08,41.42 8.8,42.69 7.59,42.69 SCREW-OUT.8 SCREW-OUT2.8
  Bottom 0.254: SMA-OUT7.CLK U$16.2 117.43,35 BNC-OUT7.1 110,38.65 105.96,42.69 v19.6,42.69 | HEADER-OUT.18 14,73.89 | 14,73.89 HEADER-OUT.17 7.5,67.66 SCREW-OUT.8 | 14,73.89 13.58,73.47 5.5,81.56 5.5,92.34 6.27,93.1 6.27,114.44 8.17,116.35 8.17,143.02 1.82,149.37 1.82,165.88 2.45,166.51 4.36,166.51 4.37,166.51 J4.10
GND  (via drill 0.35, 3.5 pad 7, 6.5 pad 14)
  Bottom 0.254: J4.13 | J4.PAD1 10.08,158.38 v10.08,158.9 10.08,162 10.77,162.7 J4.13 | X1.2 2.34,19.19 v3.73,19.19 | 44.77,173.1 BNC-IN0.2 | 44.37,172.87 44.37,173.5 44.77,173.1 | U$2.1 63.63,172.57 BNC-IN1.2 | BNC-IN2.2 88.97,172.23 95.8,172.23 95.8,172.57 U$3.1 | BNC-IN3.2 119.47,173.1 U$4.1 120.3,172.87 120.56,172.87 | U$8.1 113.63,147.57 BNC-IN7.2 | U$20.1 113.63,122.57 BNC-IN11.2 | U$19.1 88.63,122.57 BNC-IN10.2 | U$7.1 88.63,147.57 BNC-IN6.2 | U$6.1 63.63,147.57 BNC-IN5.2 | U$5.1 38.63,147.57 BNC-IN4.2 | U$17.1 38.63,122.57 BNC-IN8.2 | U$18.1 64.23,122.57 BNC-IN9.2 | U$21.1 38.63,97.57 BNC-IN12.2 | U$22.1 63.63,97.57 BNC-IN13.2 | U$23.1 88.63,97.57 BNC-IN14.2 | U$24.1 113.63,97.57 BNC-IN15.2 | U$12.1 113.63,62.57 BNC-OUT3.2 | U$11.1 88.63,62.57 BNC-OUT2.2 | U$10.1 69.47,63.1 BNC-OUT1.2 | U$9.1 44.47,63.1 BNC-OUT0.2 | 37.38,37.61 44.96,37.61 U$13.1 38.63,37.57 BNC-OUT4.2 | U$14.1 63.63,37.57 BNC-OUT5.2 | U$15.1 88.63,37.57 BNC-OUT6.2 | U$16.1 113.63,37.57 BNC-OUT7.2 | HEADER-IN.19 HEADER-IN.20 17.13,142.29 17.13,150.88 17.06,150.95 17.06,161.44 15.8,162.7 J4.13 | 10.08,182.39 v11.98,182.39 8.4,182.39 J4.PAD2 | v10.08,177.31 J4.14 | U$1.1 44.77,172.8 44.77,173.1
  other vias: 130,5 5,5 5,190 130,190 2.5,141.2 2.4,126.3 2.3,134.5 2.7,69 2.8,72.9 2.9,78.3 69,10 69.5,185
  pour Top (isolate 1.27): -5,200 140,200 140,-5 -5,-5
  pour Bottom: 0,81.3 5.5,81.3 5.5,67.2 0,67.2
N$1
  pour Bottom: -0.2,195.2 135.2,195.2 135.2,-0.2 -0.2,-0.2 -0.2,8.5 126.5,8.5 126.5,186.6 -0.2,186.6

### Text on the board
tPlace: M6 / 1/4"-20 | 21x M3, ~5mm | Analog IO / Breakout Board | <- 1" -> | <- 1" -> | Rev. 1.0 / CERN OHL v1.2 / JV, MIT / 2019 | gnd | Analog I/O | bank 1 | bank 1 | bank 1 | bank 1 | ch. 1 | ch. 2 | ch. 3 | ch. 4 | 1 | 2 | 3 | 4 | bank 1 | bank 1 | bank 1 | bank 1 | gnd | gnd | ch. 5 | ch. 6 | ch. 7 | ch. 8 | 15 | 16 | 5 | 6 | 7 | 8 | Input | in | 1 | 2 | bank 2 | bank 2 | bank 2 | bank 2 | gnd | gnd | ch. 1 | ch. 2 | ch. 3 | ch. 4 | 8 | 9 | 10 | 11 | 12 | in | bank 2 | bank 2 | bank 2 | bank 2 | 1 | ch. 5 | ch. 6 | ch. 7 | ch. 8 | gnd | GND | 13 | 14 | 15 | 16 | gnd | gnd | gnd | <- 1" -> | 15 | 16 | out | 1 | 2 | gnd | gnd | 1 | 2 | 3 | 4 | 8 | Output | out | 5 | 6 | 7 | 8 | 1 | out | gnd | chs 1&2 | <- 1" -> | <- 1" ->
bPlace: Rev. 1.0 / CERN OHL v1.2 / JPN, JV, MWL@MIT / 2019